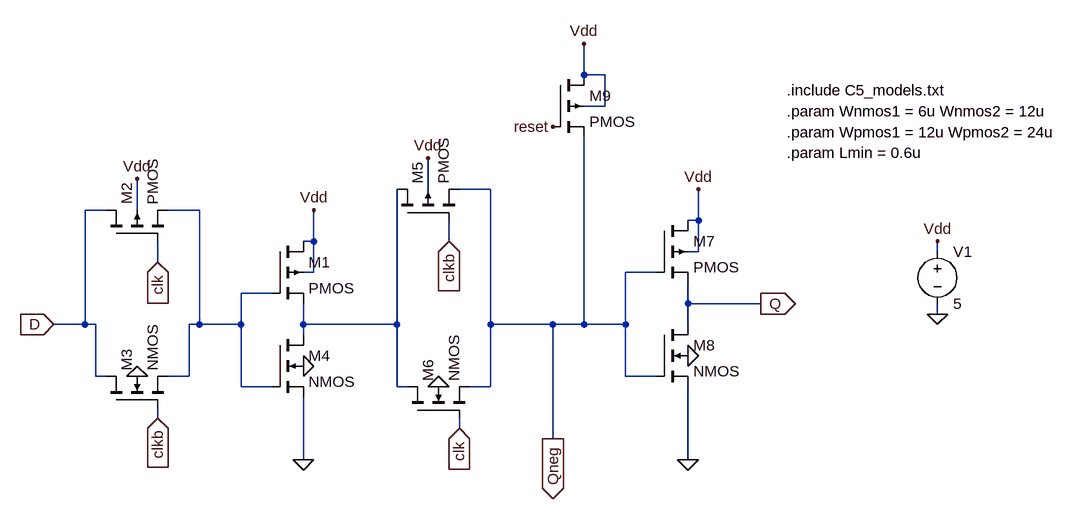
[diagram p0: schematic shift.asc]
shift.asc, the LTspice schematic file:
Version 4
SHEET 1 1228 680
WIRE 464 -112 464 -160
WIRE 496 -112 464 -112
WIRE 496 -64 496 -112
WIRE 496 -64 464 -64
WIRE 224 64 224 16
WIRE 320 64 272 64
WIRE -272 96 -304 96
WIRE -224 96 -224 48
WIRE -128 96 -176 96
WIRE 640 112 640 64
WIRE 640 112 624 112
WIRE 48 144 48 96
WIRE 48 144 32 144
WIRE 256 144 256 112
WIRE 640 160 640 112
WIRE 640 160 624 160
WIRE 1008 160 1008 144
WIRE -192 176 -192 144
WIRE 48 192 48 144
WIRE 48 192 32 192
WIRE 576 192 528 192
WIRE -16 224 -64 224
WIRE 624 240 624 208
WIRE 736 240 624 240
WIRE 1008 256 1008 240
WIRE -304 272 -304 96
WIRE -304 272 -352 272
WIRE -288 272 -304 272
WIRE -128 272 -128 96
WIRE -128 272 -144 272
WIRE -64 272 -64 224
WIRE -64 272 -128 272
WIRE 32 272 32 240
WIRE 176 272 176 64
WIRE 176 272 32 272
WIRE 320 272 320 64
WIRE 416 272 320 272
WIRE 464 272 464 -16
WIRE 464 272 416 272
WIRE 528 272 528 192
WIRE 528 272 464 272
WIRE 624 272 624 240
WIRE 32 288 32 272
WIRE -288 352 -288 272
WIRE -272 352 -288 352
WIRE -144 352 -144 272
WIRE -144 352 -176 352
WIRE 528 352 528 272
WIRE 576 352 528 352
WIRE -64 368 -64 272
WIRE -16 368 -64 368
WIRE 176 368 176 272
WIRE 192 368 176 368
WIRE 320 368 320 272
WIRE 320 368 288 368
WIRE -192 416 -192 400
WIRE 272 432 272 416
WIRE 416 448 416 272
WIRE 32 480 32 384
WIRE 624 480 624 368
FLAG 48 96 Vdd
FLAG -224 352 0
FLAG -224 48 Vdd
FLAG -352 272 D
IOPIN -352 272 In
FLAG -192 176 clk
IOPIN -192 176 In
FLAG -192 416 clkb
IOPIN -192 416 In
FLAG 32 336 0
FLAG 32 480 0
FLAG 240 368 0
FLAG 224 16 Vdd
FLAG 256 144 clkb
IOPIN 256 144 In
FLAG 272 432 clk
IOPIN 272 432 In
FLAG 640 64 Vdd
FLAG 624 320 0
FLAG 624 480 0
FLAG 464 -160 Vdd
FLAG 416 -32 reset
FLAG 736 240 Q
IOPIN 736 240 Out
FLAG 1008 256 0
FLAG 1008 144 Vdd
FLAG 416 448 Qneg
IOPIN 416 448 Out
SYMBOL pmos4 -16 144 R0
SYMATTR InstName M1
SYMATTR Value2 l='Lmin' w='Wpmos1' ad='Lmin*Wpmos1' as='Lmin*Wpmos1' pd='2*(Lmin+Wpmos1)' ps='2*(Lmin+Wpmos1)' m=1
SYMBOL pmos4 -272 144 R270
SYMATTR InstName M2
SYMATTR Value2 l='Lmin' w='Wpmos1' ad='Lmin*Wpmos1' as='Lmin*Wpmos1' pd='2*(Lmin+Wpmos1)' ps='2*(Lmin+Wpmos1)' m=1
SYMBOL nmos4 -272 400 R270
SYMATTR InstName M3
SYMATTR Value2 l='Lmin' w='Wnmos1' ad='Lmin*Wnmos1' as='Lmin*Wnmos1' pd='2*(Lmin+Wnmos1)' ps='2*(Lmin+Wnmos1)' m=1
SYMBOL nmos4 -16 288 R0
SYMATTR InstName M4
SYMATTR Value2 l='Lmin' w='Wnmos1' ad='Lmin*Wnmos1' as='Lmin*Wnmos1' pd='2*(Lmin+Wnmos1)' ps='2*(Lmin+Wnmos1)' m=1
SYMBOL pmos4 176 112 R270
SYMATTR InstName M5
SYMATTR Value2 l='Lmin' w='Wpmos1' ad='Lmin*Wpmos1' as='Lmin*Wpmos1' pd='2*(Lmin+Wpmos1)' ps='2*(Lmin+Wpmos1)' m=1
SYMBOL nmos4 192 416 R270
SYMATTR InstName M6
SYMATTR Value2 l='Lmin' w='Wnmos1' ad='Lmin*Wnmos1' as='Lmin*Wnmos1' pd='2*(Lmin+Wnmos1)' ps='2*(Lmin+Wnmos1)' m=1
SYMBOL pmos4 576 112 R0
SYMATTR InstName M7
SYMATTR Value2 l='Lmin' w='Wpmos2' ad='Lmin*Wpmos2' as='Lmin*Wpmos2' pd='2*(Lmin+Wpmos2)' ps='2*(Lmin+Wpmos2)' m=1
SYMBOL nmos4 576 272 R0
SYMATTR InstName M8
SYMATTR Value2 l='Lmin' w='Wnmos2' ad='Lmin*Wnmos2' as='Lmin*Wnmos2' pd='2*(Lmin+Wnmos2)' ps='2*(Lmin+Wnmos2)' m=1
SYMBOL pmos4 416 -112 R0
SYMATTR InstName M9
SYMATTR Value2 l='Lmin' w='Wpmos1' ad='Lmin*Wpmos1' as='Lmin*Wpmos1' pd='2*(Lmin+Wpmos1)' ps='2*(Lmin+Wpmos1)' m=1
SYMBOL voltage 1008 144 R0
WINDOW 123 0 0 Left 0
WINDOW 39 0 0 Left 0
SYMATTR InstName V1
SYMATTR Value 5
TEXT 776 -88 Left 2 !.include C5_models.txt
TEXT 776 -56 Left 2 !.param Wnmos1 = 6u Wnmos2 = 12u
TEXT 776 -24 Left 2 !.param Wpmos1 = 12u Wpmos2 = 24u
TEXT 776 8 Left 2 !.param Lmin = 0.6u

The netlist it stands for:
* shift.asc
M1 Vdd N001 N002 Vdd PMOS l='Lmin' w='Wpmos1' ad='Lmin*Wpmos1' as='Lmin*Wpmos1' pd='2*(Lmin+Wpmos1)' ps='2*(Lmin+Wpmos1)' m=1
M2 D clk N001 Vdd PMOS l='Lmin' w='Wpmos1' ad='Lmin*Wpmos1' as='Lmin*Wpmos1' pd='2*(Lmin+Wpmos1)' ps='2*(Lmin+Wpmos1)' m=1
M3 D clkb N001 0 NMOS l='Lmin' w='Wnmos1' ad='Lmin*Wnmos1' as='Lmin*Wnmos1' pd='2*(Lmin+Wnmos1)' ps='2*(Lmin+Wnmos1)' m=1
M4 N002 N001 0 0 NMOS l='Lmin' w='Wnmos1' ad='Lmin*Wnmos1' as='Lmin*Wnmos1' pd='2*(Lmin+Wnmos1)' ps='2*(Lmin+Wnmos1)' m=1
M5 N002 clkb Qneg Vdd PMOS l='Lmin' w='Wpmos1' ad='Lmin*Wpmos1' as='Lmin*Wpmos1' pd='2*(Lmin+Wpmos1)' ps='2*(Lmin+Wpmos1)' m=1
M6 N002 clk Qneg 0 NMOS l='Lmin' w='Wnmos1' ad='Lmin*Wnmos1' as='Lmin*Wnmos1' pd='2*(Lmin+Wnmos1)' ps='2*(Lmin+Wnmos1)' m=1
M7 Vdd Qneg Q Vdd PMOS l='Lmin' w='Wpmos2' ad='Lmin*Wpmos2' as='Lmin*Wpmos2' pd='2*(Lmin+Wpmos2)' ps='2*(Lmin+Wpmos2)' m=1
M8 Q Qneg 0 0 NMOS l='Lmin' w='Wnmos2' ad='Lmin*Wnmos2' as='Lmin*Wnmos2' pd='2*(Lmin+Wnmos2)' ps='2*(Lmin+Wnmos2)' m=1
M9 Vdd reset Qneg Vdd PMOS l='Lmin' w='Wpmos1' ad='Lmin*Wpmos1' as='Lmin*Wpmos1' pd='2*(Lmin+Wpmos1)' ps='2*(Lmin+Wpmos1)' m=1
V1 Vdd 0 5
.model NMOS NMOS
.model PMOS PMOS
.lib standard.mos
.include C5_models.txt
.param Wnmos1 = 6u Wnmos2 = 12u
.param Wpmos1 = 12u Wpmos2 = 24u
.param Lmin = 0.6u
.backanno
.end